# Altium schematic sheet Remote Feedback.SchDoc
size A3
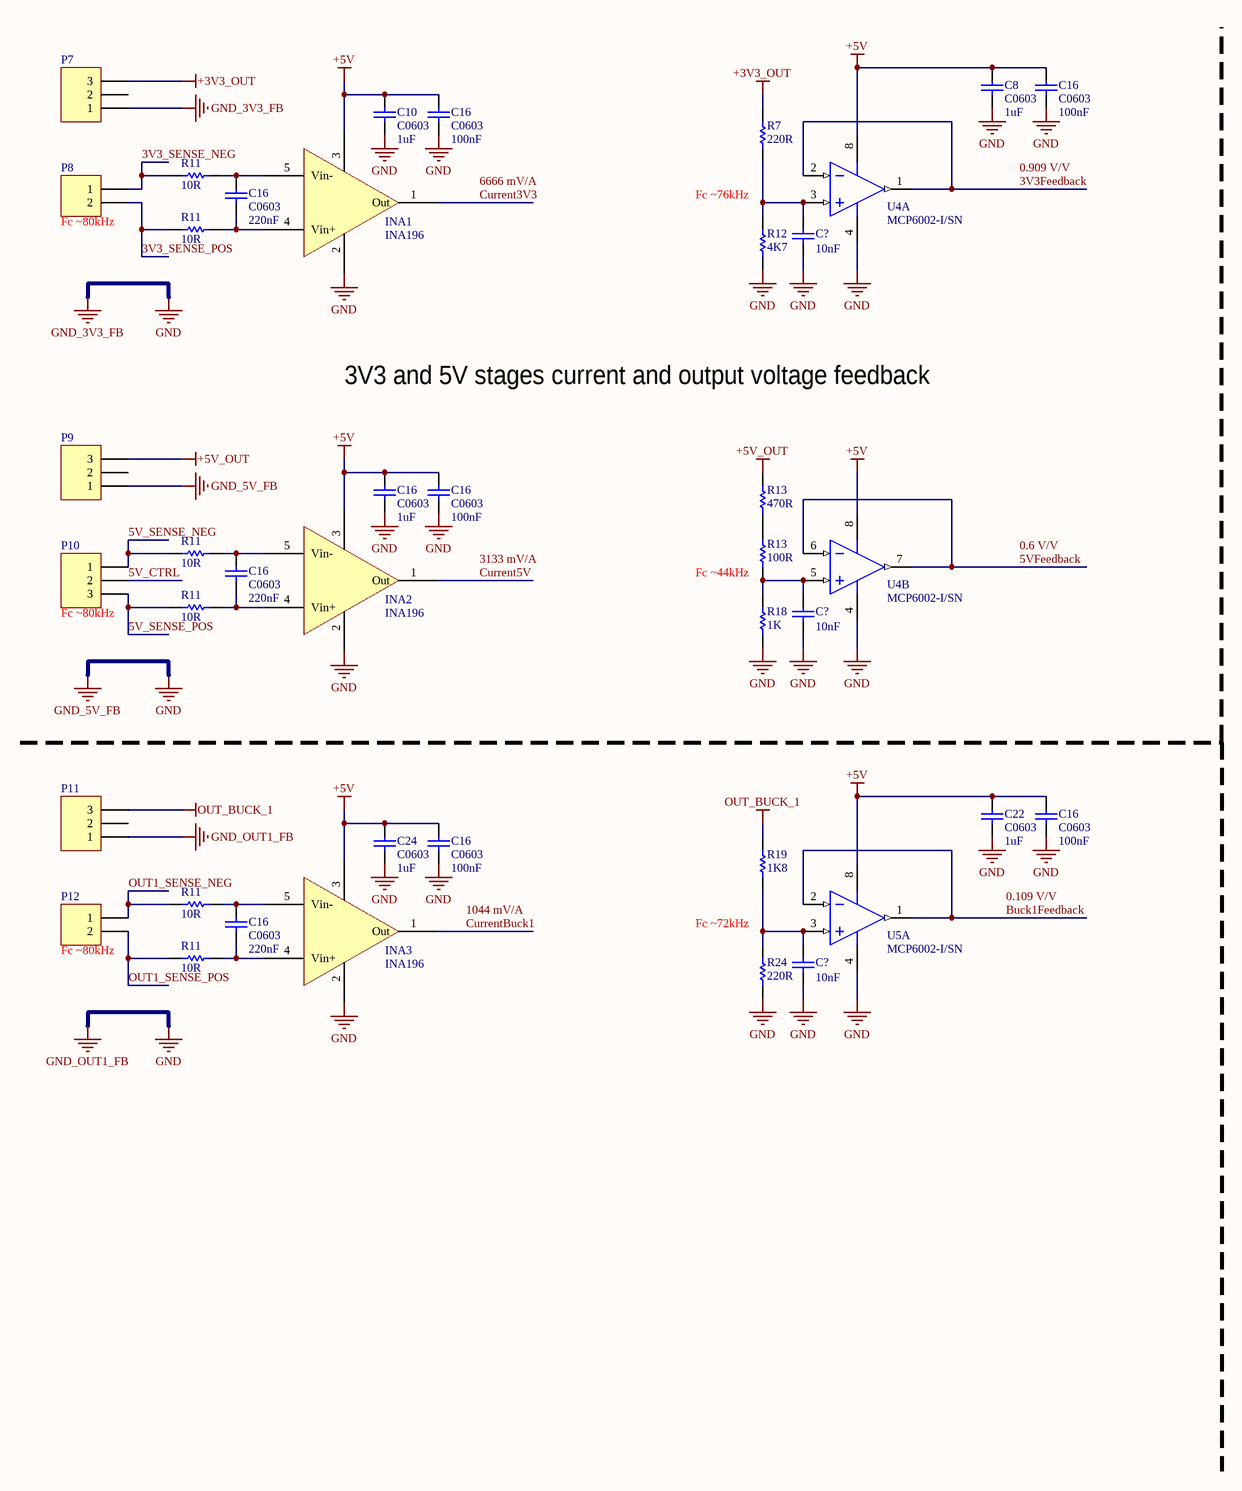
[diagram p0: Remote Feedback.SchDoc]

## Parts
(Parts that share a designator on the sheet are numbered #1, #2 ... from top to bottom, then left to right.)
C8  C0603  value 1uF  [0603]
C10  C0603  value 1uF  [0603]
C16#1  C0603  value 100nF  [0603]
C16#2  C0603  value 100nF  [0603]
C16#3  C0603  value 220nF  [0603]
C16#4  C0603  value 1uF  [0603]
C16#5  C0603  value 100nF  [0603]
C16#6  C0603  value 220nF  [0603]
C16#7  C0603  value 100nF  [0603]
C16#8  C0603  value 100nF  [0603]
C16#9  C0603  value 220nF  [0603]
C22  C0603  value 1uF  [0603]
C24  C0603  value 1uF  [0603]
C?#1  value 10nF  [C0805]  (hidden comment: CDR01)
C?#2  value 10nF  [C0805]  (hidden comment: CDR01)
C?#3  value 10nF  [C0805]  (hidden comment: CDR01)
INA1  INA196  [SOT-23-5]
INA2  INA196  [SOT-23-5]
INA3  INA196  [SOT-23-5]
P7  Header 3  [My_1X03]  (value not drawn)
P8  Header 2  [HDR1X2]  (value not drawn)
P9  Header 3  [My_1X03]  (value not drawn)
P10  Header 3  [My_1X03]  (value not drawn)
P11  Header 3  [My_1X03]  (value not drawn)
P12  Header 2  [HDR1X2]  (value not drawn)
R7  value 220R  [8RB-1206]  (hidden comment: SMD)
R11#1  10R  [ERA-0603]
R11#2  10R  [ERA-0603]
R11#3  10R  [ERA-0603]
R11#4  10R  [ERA-0603]
R11#5  10R  [ERA-0603]
R11#6  10R  [ERA-0603]
R12  value 4K7  [8RB-1206]  (hidden comment: SMD)
R13#1  value 470R  [8RB-1206]  (hidden comment: SMD)
R13#2  value 100R  [8RB-1206]  (hidden comment: SMD)
R18  value 1K  [8RB-1206]  (hidden comment: SMD)
R19  value 1K8  [8RB-1206]  (hidden comment: SMD)
R24  value 220R  [8RB-1206]  (hidden comment: SMD)
U4  MCP6002-I/SN  [SOIC-SN8_N]  (parts A,B of 2)
U5  MCP6002-I/SN  [SOIC-SN8_N]  (part A of 2)

## Nets
+3V3_OUT: P7.3 R7.2
+5V: C8.2 C10.2 C16#1.2 C16#2.2 C16#4.2 C16#5.2 C16#7.2 C16#8.2 C22.2 C24.2 INA1.3 INA2.3 INA3.3 U4.8(VDD) U5.8(VDD)
+5V_OUT: P9.3 R13#1.2
GND: C8.1 C10.1 C16#1.1 C16#2.1 C16#4.1 C16#5.1 C16#7.1 C16#8.1 C22.1 C24.1 C?#1.1 C?#2.1 C?#3.1 INA1.2(GND) INA2.2(GND) INA3.2(GND) P7.1 P9.1 P11.1 R12.1 R18.1 R24.1 U4.4(VSS) U5.4(VSS)  [also labelled GND_3V3_FB, GND_5V_FB, GND_OUT1_FB]
OUT_BUCK_1: P11.3 R19.2
3V3_SENSE_NEG: P8.1 R11#1.2
3V3_SENSE_POS: P8.2 R11#2.2
3V3Feedback: U4.1(VOUTA) U4.2(VINA-)
5V_CTRL: P10.2
5V_SENSE_NEG: P10.1 R11#3.2
5V_SENSE_POS: P10.3 R11#4.2
5VFeedback: U4.6(VINB-) U4.7(VOUTB)
Buck1Feedback: U5.1(VOUTA) U5.2(VINA-)
Current3V3: INA1.1(Out)
Current5V: INA2.1(Out)
CurrentBuck1: INA3.1(Out)
OUT1_SENSE_NEG: P12.1 R11#5.2
OUT1_SENSE_POS: P12.2 R11#6.2
NetC16#3_1: C16#3.1 INA1.4(Vin+) R11#2.1
NetC16#3_2: C16#3.2 INA1.5(Vin-) R11#1.1
NetC16#6_1: C16#6.1 INA2.4(Vin+) R11#4.1
NetC16#6_2: C16#6.2 INA2.5(Vin-) R11#3.1
NetC16#9_1: C16#9.1 INA3.4(Vin+) R11#6.1
NetC16#9_2: C16#9.2 INA3.5(Vin-) R11#5.1
NetC?#1_2: C?#1.2 R7.1 R12.2 U4.3(VINA+)
NetC?#2_2: C?#2.2 R13#2.1 R18.2 U4.5(VINB+)
NetC?#3_2: C?#3.2 R19.1 R24.2 U5.3(VINA+)
NetR13#1_1: R13#1.1 R13#2.2

Not connected (* = marked no-connect by the designer): P7 2; P9 2; P11 2

## Notes on the sheet
- (near P8) Fc ~80kHz
- Fc ~76kHz
- 3V3 and 5V stages current and output voltage feedback
- (near R13#2) Fc ~44kHz
- (near P10) Fc ~80kHz
- (near P12) Fc ~80kHz
- Fc ~72kHz
- Labels drawn without touching a wire or pin: 0.6 V/V, 0.109 V/V, 0.909 V/V, 1044 mV/A, 3133 mV/A, 6666 mV/A

## Library data of the parts
C8 C10 C16#1-C16#9 C22 C24 = C0603: C1608X7R1C105K X7R; Note: Footprint corresponds to dimensions for bulk cassette packaging. This case size has tightened tolerances.; Published: 17-Jul-2002; LatestRevisionDate: 19-Mar-2004; LatestRevisionNote: Silkscreen size reduced.; DatasheetDocument: Mar-2001; PackageDocument: Mar-2001; PackageReference: 0603; Publisher: Altium Limited; Code_JEITA: 0603; Code_IPC: 1608 [0603]; ComponentLink1Description: Manufacturer Link; ComponentLink1URL: http://www.kemet.com/; ComponentLink2Description: Datasheet; ComponentLink2URL: http://www.kemet.com/kemet/web/homepage/kechome.nsf/vapubfilesname/F3102TA.pdf/$file/F3102TA.pdf
C?#1-C?#3 = CDR01: Ceramic Chip Capacitor - MIL-PRF-55681; Published: 17-Jul-2002; LatestRevisionDate: 19-Mar-2004; LatestRevisionNote: Silkscreen size reduced.; DatasheetDocument: Mar-2001; PackageDocument: Mar-2001; PackageReference: C0805; Publisher: Altium Limited; Code_JEITA: 0805; Code_IPC: 2012[0805]; ComponentLink1Description: Manufacturer Link; ComponentLink1URL: http://www.kemet.com/; ComponentLink2Description: Datasheet; ComponentLink2URL: http://www.kemet.com/kemet/web/homepage/kechome.nsf/vapubfilesname/F3102TA.pdf/$file/F3102TA.pdf
INA1-INA3 = INA196: Current Shunt Monitor −16 V to +80 V Common-Mode Range
P7 P9-P11 = Header 3: Header, 3-Pin; LatestRevisionDate: 17-Jul-2002; LatestRevisionNote: Re-released for DXP Platform.; Publisher: Altium Limited
P8 P12 = Header 2: Header, 2-Pin; LatestRevisionDate: 17-Jul-2002; LatestRevisionNote: Re-released for DXP Platform.; Publisher: Altium Limited
R7 R12 R13#1 R13#2 R18 R19 R24 = ERJ8BQ: Low Ohmic Value Thick Film Chip Resistor, 0.22 Ohm to 9.1 Ohm Range, 1%, 2% and 5% Tolerance, 1206 Size, 0.33 W; Published: 17-Dec-2003; LatestRevisionDate: 19-Mar-2004; LatestRevisionNote: Silkscreen size reduced.; PackageDocument: Mar-2003; PackageReference: 8RB-1206; Publisher: Altium Limited; Code_IPC: 3216 [1206]; ComponentLink1Description: Manufacturer Link; ComponentLink1URL: http://www.panasonic.com/industrial/components/resistive_products.htm; ComponentLink2Description: Datasheet; ComponentLink2URL: http://www.panasonic.com/industrial/components/pdf/AOA0000CE3.pdf
R11#1-R11#6 = ERA3Y: Rectangular Thick Film Chip Resistor, 10 Ohm to 330k Ohm Range, 0.1% and 0.5% Tolerance, 0603 Size, 0.063 W; Note: If flow soldering, adjust pad width of PCB Footprint to 0.7 - 0.8 times the width of the resistor.; Published: 17-Dec-2003; LatestRevisionDate: 19-Mar-2004; LatestRevisionNote: Silkscreen size reduced.; PackageDocument: Mar-2003; PackageReference: ERA-0603; Publisher: Altium Limited; Code_IPC: 1608 [0603]; ComponentLink1Description: Manufacturer Link; ComponentLink1URL: http://www.panasonic.com/industrial/components/resistive_products.htm; ComponentLink2Description: Datasheet; ComponentLink2URL: http://www.panasonic.com/industrial/components/pdf/AOA0000CE8.pdf
U4 U5 = MCP6002-I/SN: 1 MHz, Low-Power Operational Amplifier, 8-Pin SOIC, Industrial Temperature; Published: 29-Jan-2009; LatestRevisionDate: 02-Dec-2009; LatestRevisionNote: Updated to datasheet revision J, Nov-2009; DatasheetVersion: revJ, Nov-2009; PackageVersion: revBB, Aug-2009; PackageReference: SOIC-SN8; Publisher: Altium Limited; PackageDescription: 8-Lead Plastic Small Outline (SN) - Narrow, 3.90mm Body [SOIC]; Supplier 1: Digi-Key; Supplier Part Number 1: MCP6002-I/SN-ND; Supplier 2: Farnell; Supplier Part Number 2: 1292246; Code_JEDEC: MS-012; Code_IPC: SOIC127P600-8; ComponentLink1Description: Datasheet; ComponentLink1URL: http://ww1.microchip.com/downloads/en/DeviceDoc/21733j.pdf; ComponentLink2Description: Packaging Specification; ComponentLink2URL: http://www.microchip.com/stellent/groups/techpub_sg/documents/packagingspec/en012702.pdf; ComponentLink3Description: Microchip.com Home; ComponentLink3URL: http://www.microchip.com/